# EAGLE design Elec 2013 Combined v2 (EAGLE 6.4)
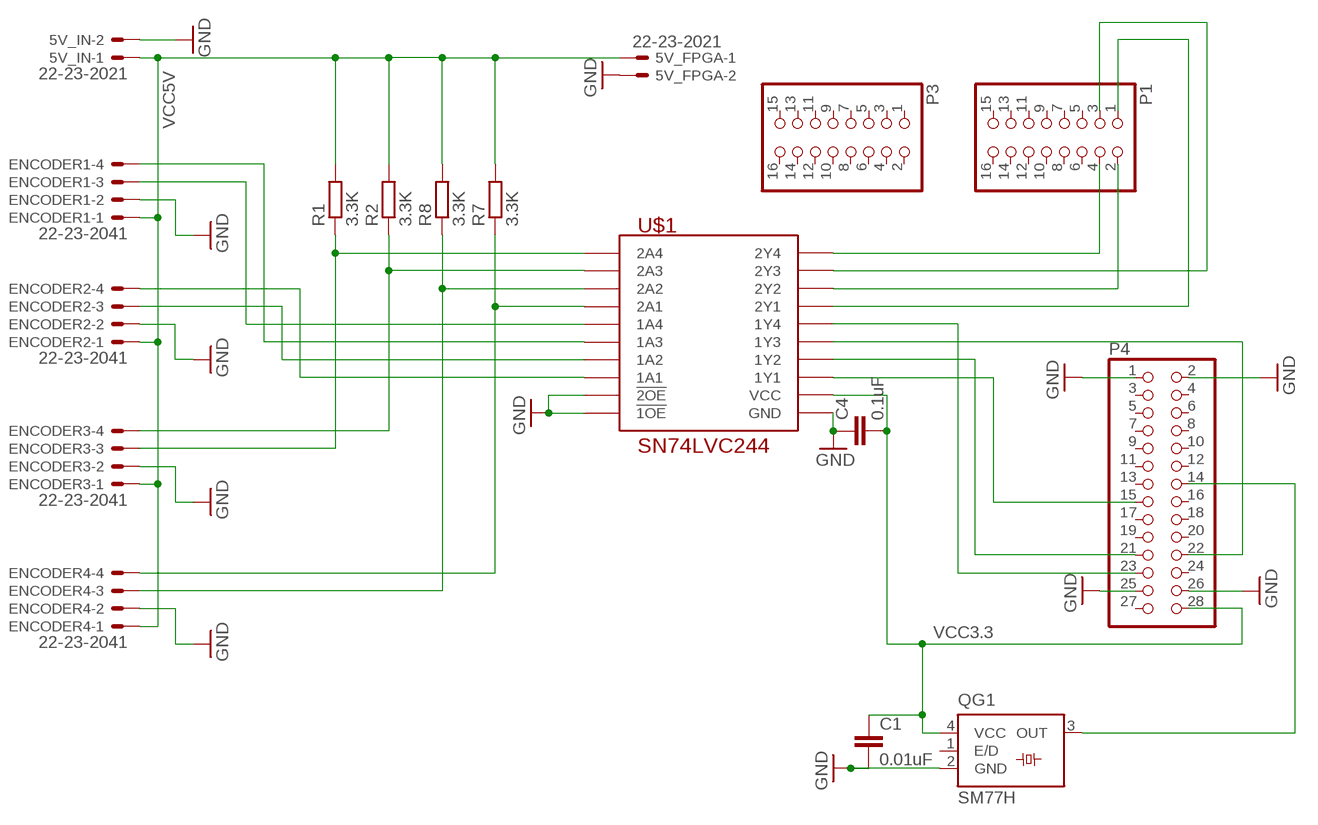
[diagram p0: schematic, sheet 1, part 1 of 2]
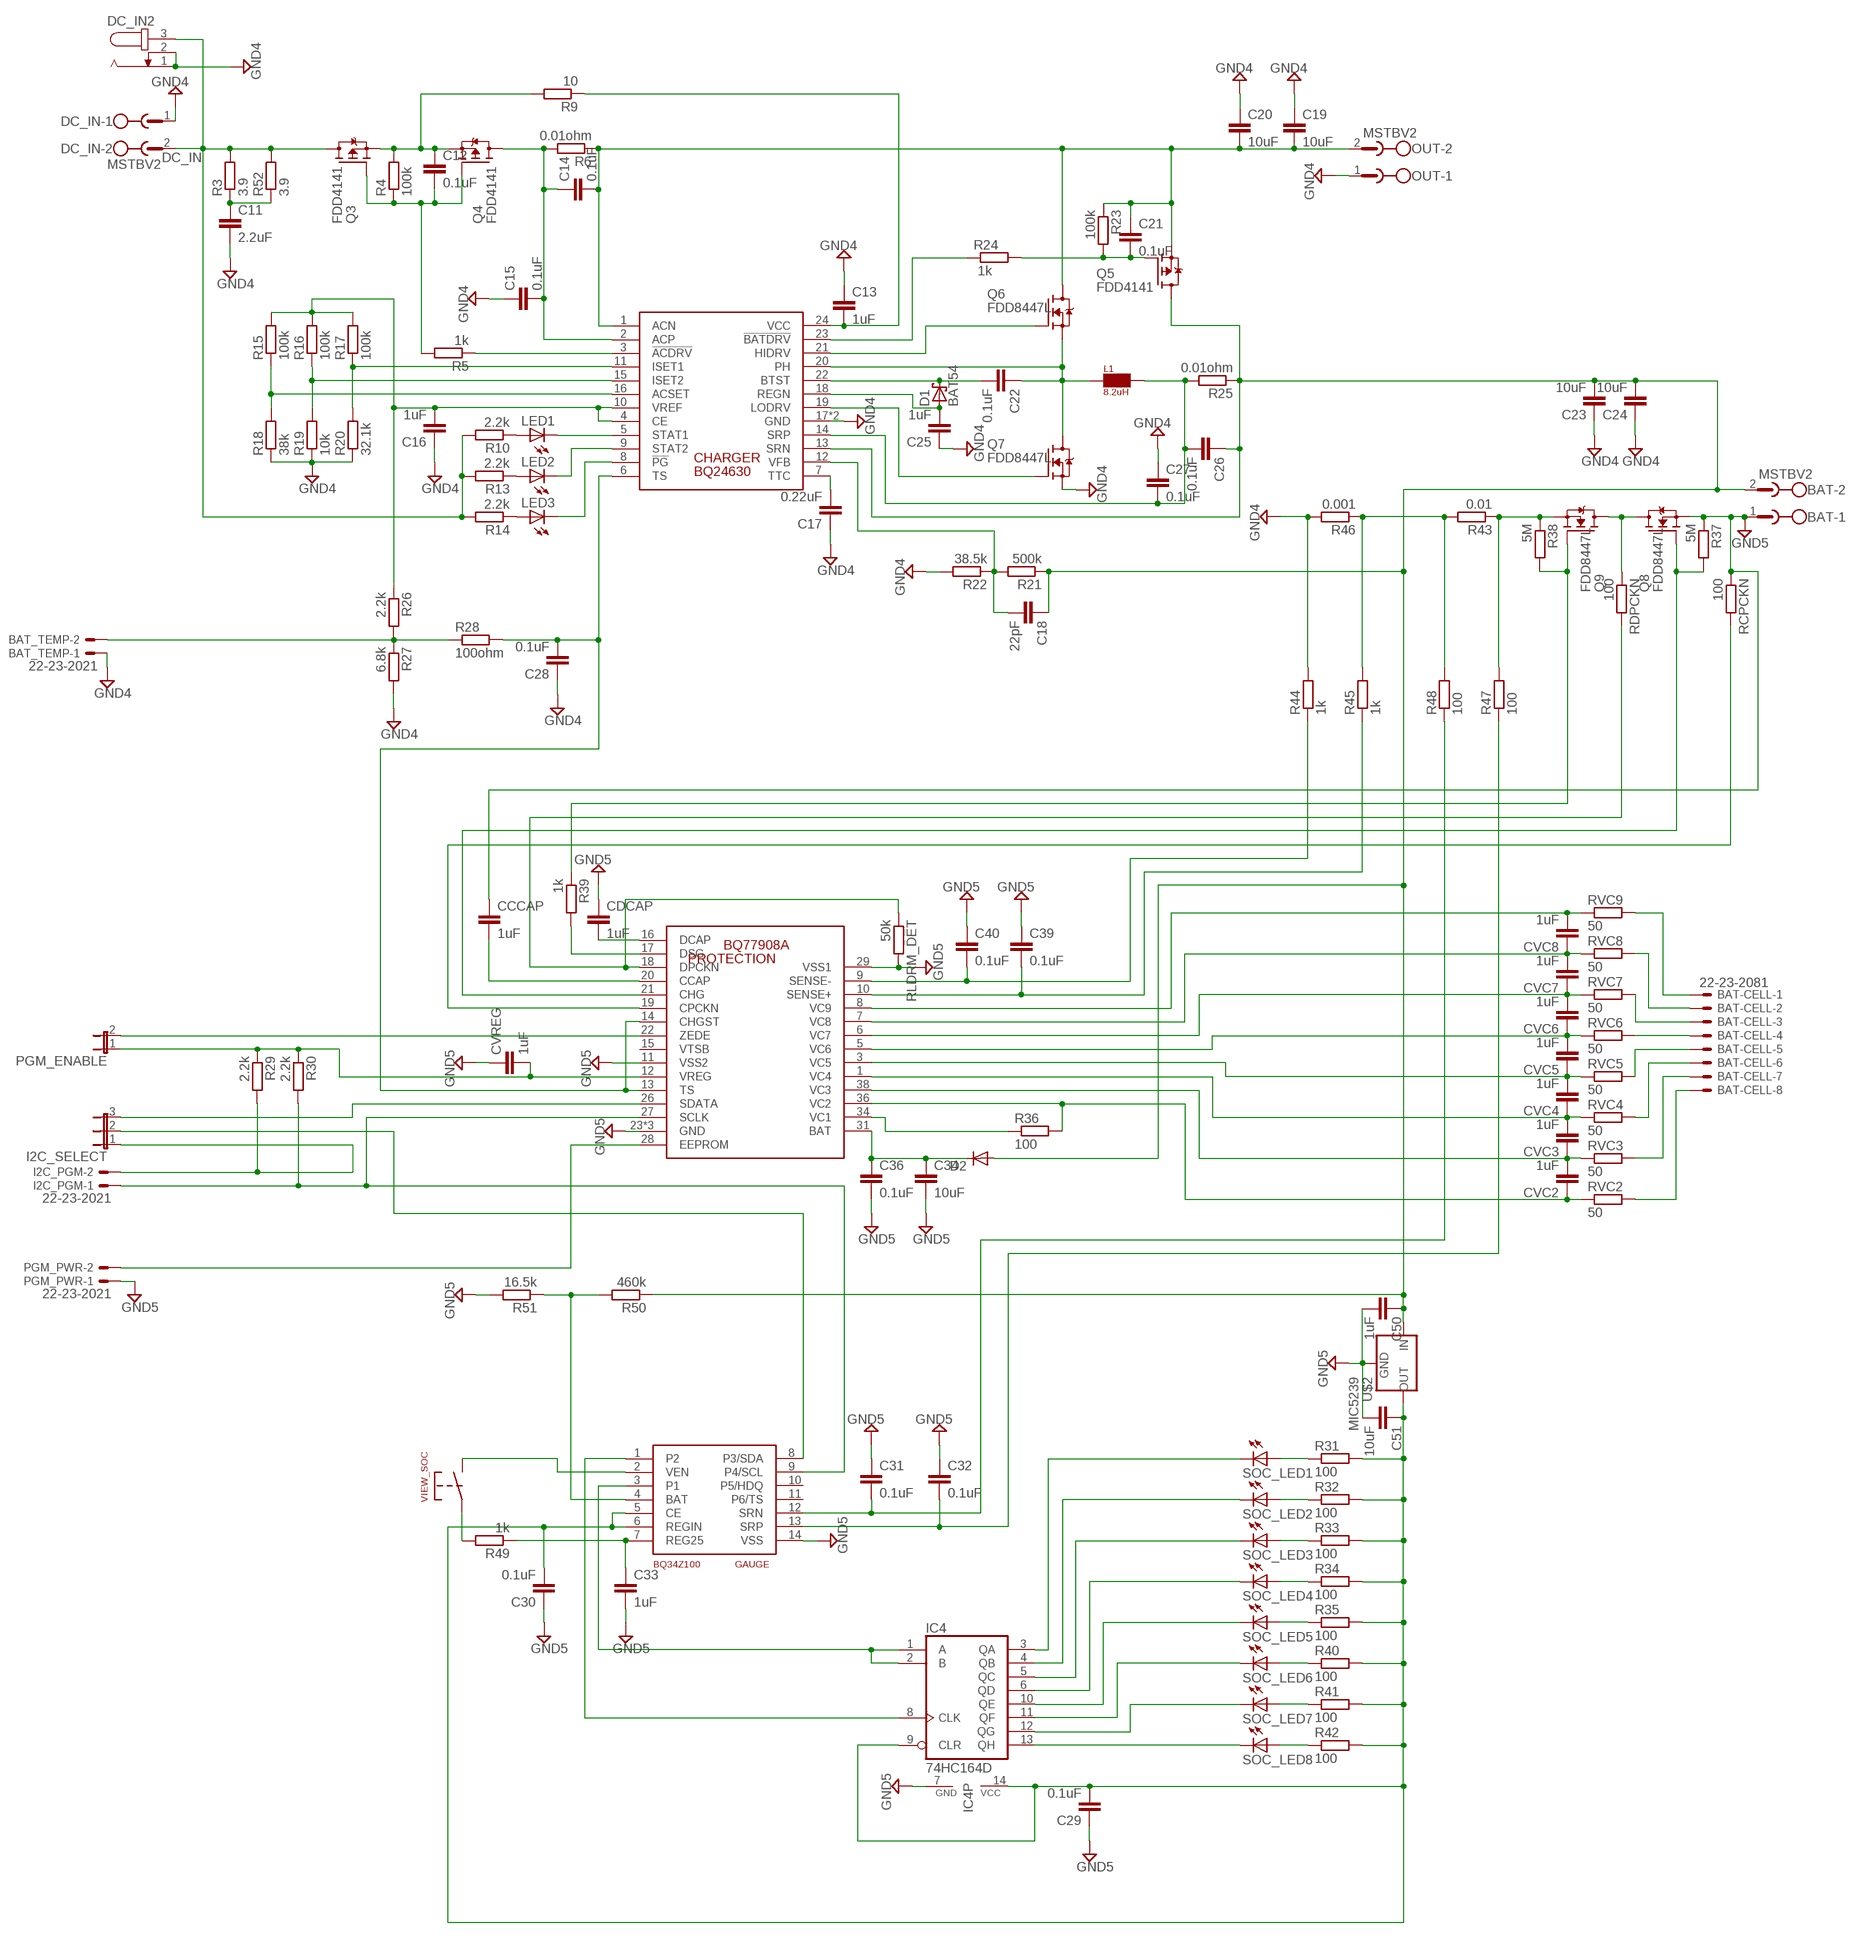
[diagram p1: schematic, sheet 1, part 2 of 2]

## Parts
5V_FPGA  22-23-2021  [22-23-2021]
5V_IN  22-23-2021  [22-23-2021]
BAT  MSTBV2  [MSTBV2]
BAT-CELL  22-23-2081  [22-23-2081]
BAT_TEMP  22-23-2021  [22-23-2021]
C1  0.01uF  C-EUC0603  [C0603]
C4  0.1uF  C-EUC0603  [C0603]
C11  2.2uF  C-EUC1206  [C1206]
C12  0.1uF  C-EUC0603  [C0603]
C13  1uF  C-EUC1206  [C1206]
C14  0.1uF  C-EUC0603  [C0603]
C15  0.1uF  C-EUC0603  [C0603]
C16  1uF  C-EUC0805  [C0805]
C17  0.22uF  C-EUC0603  [C0603]
C18  22pF  C-EUC0603  [C0603]
C19  10uF  C-EUC1812  [C1812]
C20  10uF  C-EUC1812  [C1812]
C21  0.1uF  C-EUC0603  [C0603]
C22  0.1uF  C-EUC0603  [C0603]
C23  10uF  C-EUC1812  [C1812]
C24  10uF  C-EUC1812  [C1812]
C25  1uF  C-EUC0805  [C0805]
C26  0.1uF  C-EUC0603  [C0603]
C27  0.1uF  C-EUC0603  [C0603]
C28  0.1uF  C-EUC0603  [C0603]
C29  0.1uF  C-EUC0603  [C0603]
C30  0.1uF  C-EUC0603  [C0603]
C31  0.1uF  C-EUC0603  [C0603]
C32  0.1uF  C-EUC0603  [C0603]
C33  1uF  C-EUC0603  [C0603]
C34  10uF  C-EUC1210  [C1210]
C36  0.1uF  C-EUC1210  [C1210]
C39  0.1uF  C-EUC0603  [C0603]
C40  0.1uF  C-EUC0603  [C0603]
C50  1uF  C-EUC0603  [C0603]
C51  10uF  C-EUC0603  [C0603]
CCCAP  1uF  C-EUC1206  [C1206]
CDCAP  1uF  C-EUC1206  [C1206]
CHARGER  BQ24630  [QFN-24]
CVC2  1uF  C-EUC0603  [C0603]
CVC3  1uF  C-EUC0603  [C0603]
CVC4  1uF  C-EUC0603  [C0603]
CVC5  1uF  C-EUC0603  [C0603]
CVC6  1uF  C-EUC0603  [C0603]
CVC7  1uF  C-EUC0603  [C0603]
CVC8  1uF  C-EUC0603  [C0603]
CVREG  1uF  C-EUC0603  [C0603]
D1  BAT54  [SOT23]
D2  DIODE-SOD123  [SOD123]
DC_IN  MSTBV2  [MSTBV2]
DC_IN2  JACK-PLUG1  [SPC4078]
ENCODER1  22-23-2041  [22-23-2041]
ENCODER2  22-23-2041  [22-23-2041]
ENCODER3  22-23-2041  [22-23-2041]
ENCODER4  22-23-2041  [22-23-2041]
GAUGE  BQ34Z100  [TSSOP-14-0.65MM]
I2C_PGM  22-23-2021  [22-23-2021]
I2C_SELECT  JP2E  [JP2]
IC4  74HC164D  [SO14]
L1  8.2uH  IHLP-5050CE  [5050CE]
LED1  LEDCHIP-LED0603  [CHIP-LED0603]
LED2  LEDCHIP-LED0603  [CHIP-LED0603]
LED3  LEDCHIP-LED0603  [CHIP-LED0603]
OUT  MSTBV2  [MSTBV2]
P1  PINHD-2X8  [2X08]
P3  PINHD-2X8  [2X08]
P4  PINHD-2X14  [2X14]
PGM_ENABLE  JP1E  [JP1]
PGM_PWR  22-23-2021  [22-23-2021]
PROTECTION  BQ77908A  [TSSOP-38-0.5MM]
Q3  FDD4141  FDD4141TO252  [TO252]
Q4  FDD4141  FDD4141TO252  [TO252]
Q5  FDD4141  FDD4141TO252  [TO252]
Q6  FDD8447L  [TO252]
Q7  FDD8447L  [TO252]
Q8  FDD8447L  [TO252]
Q9  FDD8447L  [TO252]
QG1  SM77H  [SM77H]
R1  3.3K  R-EU_R0603  [R0603]
R2  3.3K  R-EU_R0603  [R0603]
R3  3.9  R-EU_R1206  [R1206]
R4  100k  R-EU_R0603  [R0603]
R5  1k  R-EU_R0603  [R0603]
R6  0.01ohm  R-EU_R2010  [R2010]
R7  3.3K  R-EU_R0603  [R0603]
R8  3.3K  R-EU_R0603  [R0603]
R9  10  R-EU_R1206  [R1206]
R10  2.2k  R-EU_R0603  [R0603]
R13  2.2k  R-EU_R0603  [R0603]
R14  2.2k  R-EU_R0603  [R0603]
R15  100k  R-EU_R0805  [R0805]
R16  100k  R-EU_R0805  [R0805]
R17  100k  R-EU_R0805  [R0805]
R18  38k  R-EU_R0805  [R0805]
R19  10k  R-EU_R0805  [R0805]
R20  32.1k  R-EU_R0805  [R0805]
R21  500k  R-EU_R0805  [R0805]
R22  38.5k  R-EU_R0805  [R0805]
R23  100k  R-EU_R0603  [R0603]
R24  1k  R-EU_R0603  [R0603]
R25  0.01ohm  R-EU_R2010  [R2010]
R26  2.2k  R-EU_R0603  [R0603]
R27  6.8k  R-EU_R0603  [R0603]
R28  100ohm  R-EU_R0603  [R0603]
R29  2.2k  R-EU_R0603  [R0603]
R30  2.2k  R-EU_R0603  [R0603]
R31  100  R-EU_R0603  [R0603]
R32  100  R-EU_R0603  [R0603]
R33  100  R-EU_R0603  [R0603]
R34  100  R-EU_R0603  [R0603]
R35  100  R-EU_R0603  [R0603]
R36  100  R-EU_R0603  [R0603]
R37  5M  R-EU_R0603  [R0603]
R38  5M  R-EU_R0603  [R0603]
R39  1k  R-EU_R0603  [R0603]
R40  100  R-EU_R0603  [R0603]
R41  100  R-EU_R0603  [R0603]
R42  100  R-EU_R0603  [R0603]
R43  0.01  R-EU_R2010  [R2010]
R44  1k  R-EU_R0603  [R0603]
R45  1k  R-EU_R0603  [R0603]
R46  0.001  R-EU_R2010  [R2010]
R47  100  R-EU_R0603  [R0603]
R48  100  R-EU_R0603  [R0603]
R49  1k  R-EU_R0603  [R0603]
R50  460k  R-EU_R0805  [R0805]
R51  16.5k  R-EU_R0603  [R0603]
R52  3.9  R-EU_R1206  [R1206]
RCPCKN  100  R-EU_R0603  [R0603]
RDPCKN  100  R-EU_R0603  [R0603]
RLDRM_DET  50k  R-EU_R0603  [R0603]
RVC2  50  R-EU_R1206  [R1206]
RVC3  50  R-EU_R1206  [R1206]
RVC4  50  R-EU_R1206  [R1206]
RVC5  50  R-EU_R1206  [R1206]
RVC6  50  R-EU_R1206  [R1206]
RVC7  50  R-EU_R1206  [R1206]
RVC8  50  R-EU_R1206  [R1206]
RVC9  50  R-EU_R1206  [R1206]
SOC_LED1  LEDCHIP-LED0603  [CHIP-LED0603]
SOC_LED2  LEDCHIP-LED0603  [CHIP-LED0603]
SOC_LED3  LEDCHIP-LED0603  [CHIP-LED0603]
SOC_LED4  LEDCHIP-LED0603  [CHIP-LED0603]
SOC_LED5  LEDCHIP-LED0603  [CHIP-LED0603]
SOC_LED6  LEDCHIP-LED0603  [CHIP-LED0603]
SOC_LED7  LEDCHIP-LED0603  [CHIP-LED0603]
SOC_LED8  LEDCHIP-LED0603  [CHIP-LED0603]
U$1  SN74LVC244  [TSSOP-20-0.65MM]
U$2  MIC5239  [SOT223]
VIEW_SOC  PUSHBUTTON  [PUSHBUTTON]

## Nets
DC_IN: DC_IN2.3 DC_IN.2 Q3.3(D) R3.2 R10.2 R13.2 R14.2 R52.2
GND: 5V_FPGA.2 5V_IN.2 C1.2 C4.1 ENCODER1.2 ENCODER2.2 ENCODER3.2 ENCODER4.2 P4.1 P4.2 P4.25 P4.26 QG1.2(GND) U$1.P$1(!1OE) U$1.P$10(GND) U$1.P$19(!2OE)
GND4: BAT_TEMP.1 C11.2 C13.1 C15.1 C16.1 C17.1 C19.1 C20.1 C23.1 C24.1 C25.1 C27.1 C28.1 CHARGER.17(GND) CHARGER.THERMAL(GND) DC_IN2.1 DC_IN2.2 DC_IN.1 OUT.1 Q7.2(S) R18.1 R19.1 R20.1 R22.2 R27.2 R44.2 R46.2
GND5: BAT.1 C29.1 C30.1 C31.1 C32.1 C33.2 C34.2 C36.2 C39.1 C40.1 C50.2 C51.2 CCCAP.1 CDCAP.1 CVREG.1 GAUGE.14(VSS) IC4.7(GND) PGM_PWR.1 PROTECTION.11(VSS2) PROTECTION.23(GND) PROTECTION.24(GND) PROTECTION.25(GND) PROTECTION.29(VSS1) Q8.2(S) R37.1 R51.2 RCPCKN.1 RLDRM_DET.2 U$2.2(GND) U$2.4(GND)
N$1: P4.14 QG1.3(OUT)
N$2: P4.23 U$1.P$12(1Y4)
N$3: P4.21 U$1.P$16(1Y2)
N$4: P4.15 U$1.P$18(1Y1)
N$5: P4.22 U$1.P$14(1Y3)
N$6: P1.4 U$1.P$3(2Y4)
N$7: P1.2 U$1.P$7(2Y2)
N$8: P1.1 U$1.P$9(2Y1)
N$9: P1.3 U$1.P$5(2Y3)
N$10: ENCODER3.3 R1.1 U$1.P$17(2A4)
N$11: ENCODER3.4 R2.1 U$1.P$15(2A3)
N$13: C11.1 R3.1 R52.1
N$14: ENCODER4.3 R8.1 U$1.P$13(2A2)
N$15: ENCODER4.4 R7.1 U$1.P$11(2A1)
N$16: ENCODER1.3 U$1.P$8(1A4)
N$17: ENCODER1.4 U$1.P$6(1A3)
N$18: ENCODER2.3 U$1.P$4(1A2)
N$19: ENCODER2.4 U$1.P$2(1A1)
N$41: C12.1 Q3.2(S) Q4.2(S) R4.2 R9.2
N$42: C12.2 Q3.1(G) Q4.1(G) R4.1 R5.2
N$43: CHARGER.3(!ACDRV!) R5.1
N$44: C17.2 CHARGER.7(TTC)
N$45: C13.2 CHARGER.24(VCC) R9.1
N$46: C14.2 C19.2 C20.2 C21.1 CHARGER.1(ACN) OUT.2 Q5.2(S) Q6.3(D) R6.1 R23.1
N$47: C18.2 CHARGER.12(VFB) R21.2 R22.1
N$48: CHARGER.5(STAT1) LED1.C
N$49: CHARGER.9(STAT2) LED2.C
N$50: CHARGER.8(!PG!) LED3.C
N$51: LED1.A R10.1
N$52: LED2.A R13.1
N$53: LED3.A R14.1
N$54: BAT_TEMP.2 R26.2 R27.1 R28.1
N$55: CHARGER.16(ACSET) R15.1 R18.2
N$56: CHARGER.15(ISET2) R16.1 R19.2
N$57: CHARGER.11(ISET1) R17.1 R20.2
N$58: Q8.3(D) Q9.3(D) RDPCKN.1
N$59: C28.2 CHARGER.6(TS) PROTECTION.13(TS) PROTECTION.14(CHGST) R28.2
N$60: C21.2 Q5.1(G) R23.2 R24.2
N$61: C32.2 GAUGE.13(SRP) R47.1
N$62: CHARGER.23(!BATDRV!) R24.1
N$63: CHARGER.21(HIDRV) Q6.1(G)
N$64: C22.1 CHARGER.20(PH) L1.P$1 Q6.2(S) Q7.3(D)
N$65: C22.2 CHARGER.22(BTST) D1.3(C)
N$66: C34.1 C36.1 D2.C PROTECTION.31(BAT)
N$67: C26.2 C27.2 CHARGER.14(SRP) L1.P$2 R25.2
N$68: BAT-CELL.8 RVC2.2
N$69: C25.2 CHARGER.18(REGN) D1.1(A)
N$70: CHARGER.19(LODRV) Q7.1(G)
N$71: CVC8.2 PROTECTION.8(VC9) RVC9.1
N$72: CVC2.1 PROTECTION.36(VC2) R36.2 RVC2.1
N$73: CVC4.2 CVC5.1 PROTECTION.3(VC5) RVC5.1
N$74: CVC2.2 CVC3.1 PROTECTION.38(VC3) RVC3.1
N$75: PROTECTION.34(VC1) R36.1
N$76: CVC6.2 CVC7.1 PROTECTION.6(VC7) RVC7.1
N$77: CVC5.2 CVC6.1 PROTECTION.5(VC6) RVC6.1
N$78: CVC3.2 CVC4.1 PROTECTION.1(VC4) RVC4.1
N$79: BAT-CELL.7 RVC3.2
N$80: BAT-CELL.6 RVC4.2
N$81: BAT-CELL.5 RVC5.2
N$82: BAT-CELL.4 RVC6.2
N$83: BAT-CELL.3 RVC7.2
N$84: BAT-CELL.2 RVC8.2
N$85: BAT-CELL.1 RVC9.2
N$86: C33.1 GAUGE.7(REG25) R49.1
N$87: Q9.1(G) R38.2 R39.1
N$88: PROTECTION.21(CHG) Q8.1(G) R37.2
N$89: PROTECTION.17(DSG) R39.2
N$90: CDCAP.2 PROTECTION.16(DCAP)
N$91: CVC7.2 CVC8.1 PROTECTION.7(VC8) RVC8.1
N$92: PROTECTION.18(DPCKN) RDPCKN.2 RLDRM_DET.1
N$93: R31.1 SOC_LED1.A
N$94: PROTECTION.19(CPCKN) RCPCKN.2
N$95: CCCAP.2 PROTECTION.20(CCAP)
N$96: R32.1 SOC_LED2.A
N$97: C39.2 PROTECTION.10(SENSE+) R45.1
N$99: C40.2 PROTECTION.9(SENSE-) R44.1
N$100: GAUGE.9(P4/SCL) I2C_PGM.1 PROTECTION.27(SCLK) R30.2
N$101: I2C_PGM.2 I2C_SELECT.1 R29.2
N$102: R33.1 SOC_LED3.A
N$103: PGM_ENABLE.2 PROTECTION.22(ZEDE)
N$104: PGM_PWR.2 PROTECTION.28(EEPROM)
N$105: C29.2 C30.2 C51.1 GAUGE.5(CE) GAUGE.6(REGIN) IC4.9(CLR) IC4.14(VCC) R31.2 R32.2 R33.2 R34.2 R35.2 R40.2 R41.2 R42.2 U$2.3(OUT)
N$106: R34.1 SOC_LED4.A
N$107: R35.1 SOC_LED5.A
N$108: R40.1 SOC_LED6.A
N$109: R41.1 SOC_LED7.A
N$110: R42.1 SOC_LED8.A
N$111: IC4.13(QH) SOC_LED8.C
N$112: IC4.3(QA) SOC_LED1.C
N$113: IC4.4(QB) SOC_LED2.C
N$114: IC4.5(QC) SOC_LED3.C
N$115: IC4.6(QD) SOC_LED4.C
N$116: IC4.10(QE) SOC_LED5.C
N$118: IC4.12(QG) SOC_LED7.C
N$120: I2C_SELECT.3 PROTECTION.26(SDATA)
N$121: GAUGE.8(P3/SDA) I2C_SELECT.2
N$122: C31.2 GAUGE.12(SRN) R48.1
N$123: GAUGE.3(P1) IC4.1(A) IC4.2(B)
N$124: GAUGE.1(P2) IC4.8(CLK)
N$126: R49.2 VIEW_SOC.P$1 VIEW_SOC.P$2
N$127: GAUGE.2(VEN) VIEW_SOC.P$3 VIEW_SOC.P$4
N$128: GAUGE.4(BAT) R50.2 R51.1
N$129: BAT.2 C18.1 C23.2 C24.2 C26.1 C50.1 CHARGER.13(SRN) D2.A Q5.3(D) R21.1 R25.1 R50.1 U$2.1(IN)
N$130: CVREG.2 PGM_ENABLE.1 PROTECTION.12(VREG) R29.1 R30.1
N$131: R43.2 R45.2 R46.1 R48.2
N$132: Q9.2(S) R38.1 R43.1 R47.2
SI7617DN: C14.1 C15.2 CHARGER.2(ACP) Q4.3(D) R6.2
SOC_LED6: IC4.11(QF) SOC_LED6.C
VCC3.3: C1.1 C4.2 P4.28 QG1.4(VCC) U$1.P$20(VCC)
VCC5V: 5V_FPGA.1 5V_IN.1 ENCODER1.1 ENCODER2.1 ENCODER3.1 ENCODER4.1 R1.2 R2.2 R7.2 R8.2
VREF: C16.2 CHARGER.4(CE) CHARGER.10(VREF) R15.2 R16.2 R17.2 R26.1
Unconnected: GAUGE.10(P5/HDQ) GAUGE.11(P6/TS) P1.5 P1.6 P1.7 P1.8 P1.9 P1.10 P1.11 P1.12 P1.13 P1.14 P1.15 P1.16 P3.1 P3.2 P3.3 P3.4 P3.5 P3.6 P3.7 P3.8 P3.9 P3.10 P3.11 P3.12 P3.13 P3.14 P3.15 P3.16 P4.3 P4.4 P4.5 P4.6 P4.7 P4.8 P4.9 P4.10 P4.11 P4.12 P4.13 P4.16 P4.17 P4.18 P4.19 P4.20 P4.24 P4.27 PROTECTION.15(VTSB) QG1.1(E/D)

## Library data of the parts
5V_FPGA 5V_IN BAT_TEMP I2C_PGM PGM_PWR = con-molex:22-23-2021: .100" (2.54mm) Center Header - 2 Pin; MF: MOLEX; MPN: 22-23-2021; OC_FARNELL: 1462926; OC_NEWARK: 25C3832
BAT DC_IN OUT = con-phoenix-508:MSTBV2: PHOENIX; MPN: MSTBV 2,5/2-GF-5.08; OC_FARNELL: 1792792; OC_NEWARK: 69R9845
BAT-CELL = con-molex:22-23-2081: .100" (2.54mm) Center Header - 8 Pin; MF: MOLEX; MPN: 22-23-2081; OC_FARNELL: 1756826; OC_NEWARK: 01C7592
C1 C4 C11-C34 C36 C39 C40 C50 C51 CCCAP CDCAP CVC2-CVC8 CVREG = rcl:C-EU: CAPACITOR, European symbol
CHARGER = custom:BQ24630
D1 = diode:BAT54: Schottky Diodes Source: Fairchild .. BAT54.pdf
D2 = diode:DIODE-: DIODE
DC_IN2 = con-jack:JACK-PLUG: DC POWER JACK Power Jack, DC, Right Angle, Through Hole, Rated 5A at 16VDC, PC Terminals Distributor: Farnell (www.Farnell.de) Drawing: 84N1161.pdf / 84N1162.pdf Manufacturer: SPC Technology (www.spctechnology.com) Type: SPC4077 / SPC 4078; OC_FARNELL: unknown; OC_NEWARK: unknown
ENCODER1-ENCODER4 = con-molex:22-23-2041: .100" (2.54mm) Center Header - 4 Pin; MF: MOLEX; MPN: 22-23-2041; OC_FARNELL: 1462920; OC_NEWARK: 38C0355
GAUGE = custom:BQ34Z100
I2C_SELECT = jumper:JP2E: JUMPER
IC4 = 74xx-eu:74*164: 8-bit parallel out SHIFT REGISTER
L1 = custom:IHLP-5050CE
LED1-LED3 SOC_LED1-SOC_LED8 = led:LED: LED OSRAM: - CHIPLED LG R971, LG N971, LY N971, LG Q971, LY Q971, LO R971, LY R971 LH N974, LH R974 LS Q976, LO Q976, LY Q976 LO Q996 - Hyper CHIPLED LW Q18S LB Q993, LB Q99A, LB R99A - SideLED LS A670, LO A670, LY A670, LG A670, LP A670 LB A673, LV A673, LT A673, LW A673 LH A674 LY A675 LS A676, LA A676, LO A676, LY A676, LW A676 LS A679, LY A679, LG A679 - Hyper Micro SIDELED® LS Y876, LA Y876, LO Y876, LY Y876 LT Y87S - SmartLED LW L88C, LW L88S LB L89C, LB L89S, LG L890 LS L89K, LO L89K, LY L89K LS L896, LA L896, LO L896, LY L896 - TOPLED LS T670, LO T670, LY T670, LG T670, LP T670 LSG T670, LSP T670, LSY T670, LOP T670, LYG T670 LG T671, LOG T671, LSG T671 LB T673, LV T673, LT T673, LW T673 LH T674 LS T676, LA T676, LO T676, LY T676, LB T676, LH T676, LSB T676, LW T676 LB T67C, LV T67C, LT T67C, LS T67K, LO T67K, LY T67K, LW E67C LS E67B, LA E67B, LO E67B, LY E67B, LB E67C, LV E67C, LT E67C LW T67C LS T679, LY T679, LG T679 LS T770, LO T770, LY T770, LG T770, LP T770 LB T773, LV T773, LT T773, LW T773 LH T774 LS E675, LA E675, LY E675, LS T675 LS T776, LA T776, LO T776, LY T776, LB T776 LHGB T686 LT T68C, LB T68C - Hyper Mini TOPLED® LB M676 - Mini TOPLED Santana® LG M470 LS M47K, LO M47K, LY M47K Source: http://www.osram.convergy.de LUXEON: - LUMILED® LXK2-PW12-R00, LXK2-PW12-S00, LXK2-PW14-U00, LXK2-PW14-V00 LXK2-PM12-R00, LXK2-PM12-S00, LXK2-PM14-U00 LXK2-PE12-Q00, LXK2-PE12-R00, LXK2-PE12-S00, LXK2-PE14-T00, LXK2-PE14-U00 LXK2-PB12-K00, LXK2-PB12-L00, LXK2-PB12-M00, LXK2-PB14-N00, LXK2-PB14-P00, LXK2-PB14-Q00 LXK2-PR12-L00, LXK2-PR12-M00, LXK2-PR14-Q00, LXK2-PR14-R00 LXK2-PD12-Q00, LXK2-PD12-R00, LXK2-PD12-S00 LXK2-PH12-R00, LXK2-PH12-S00 LXK2-PL12-P00, LXK2-PL12-Q00, LXK2-PL12-R00 Source: www.luxeon.com KINGBRIGHT: KA-3528ASYC Source: www.kingbright.com
P1 P3 = pinhead:PINHD-2X8: PIN HEADER
P4 = pinhead:PINHD-2X14: PIN HEADER
PGM_ENABLE = jumper:JP1E: JUMPER
PROTECTION = custom:BQ77908A
Q3-Q5 = transistor-fet:FDD4141: P-Channel PowerTrench® MOSFET Source: FDD4141.pdf
Q6-Q9 = transistor-fet:FDD8447L
QG1 = custom:SM77H: 3.3V CMOS Clock Oscillator Source: www.pletronics.com .. sm77h%203.3v.pdf; OC_FARNELL: unknown; OC_NEWARK: unknown
R1-R10 R13-R52 RCPCKN RDPCKN RLDRM_DET RVC2-RVC9 = rcl:R-EU_: RESISTOR, European symbol
U$1 = custom:SN74LVC244
U$2 = v-reg:MIC5239
VIEW_SOC = custom:PUSHBUTTON

## Board
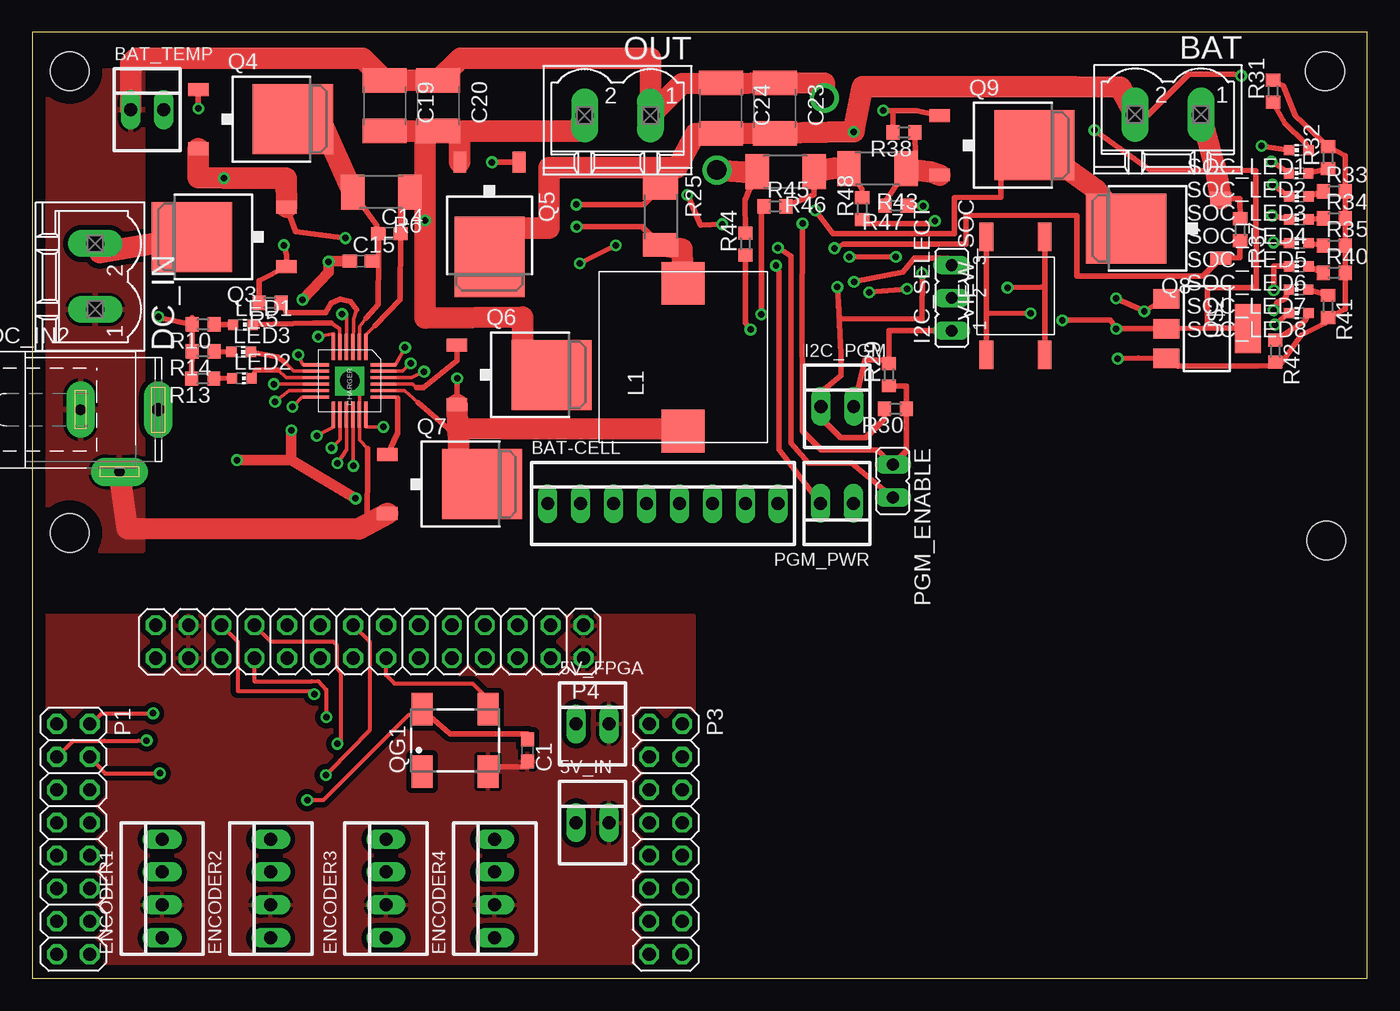
[diagram p2: board, top side]
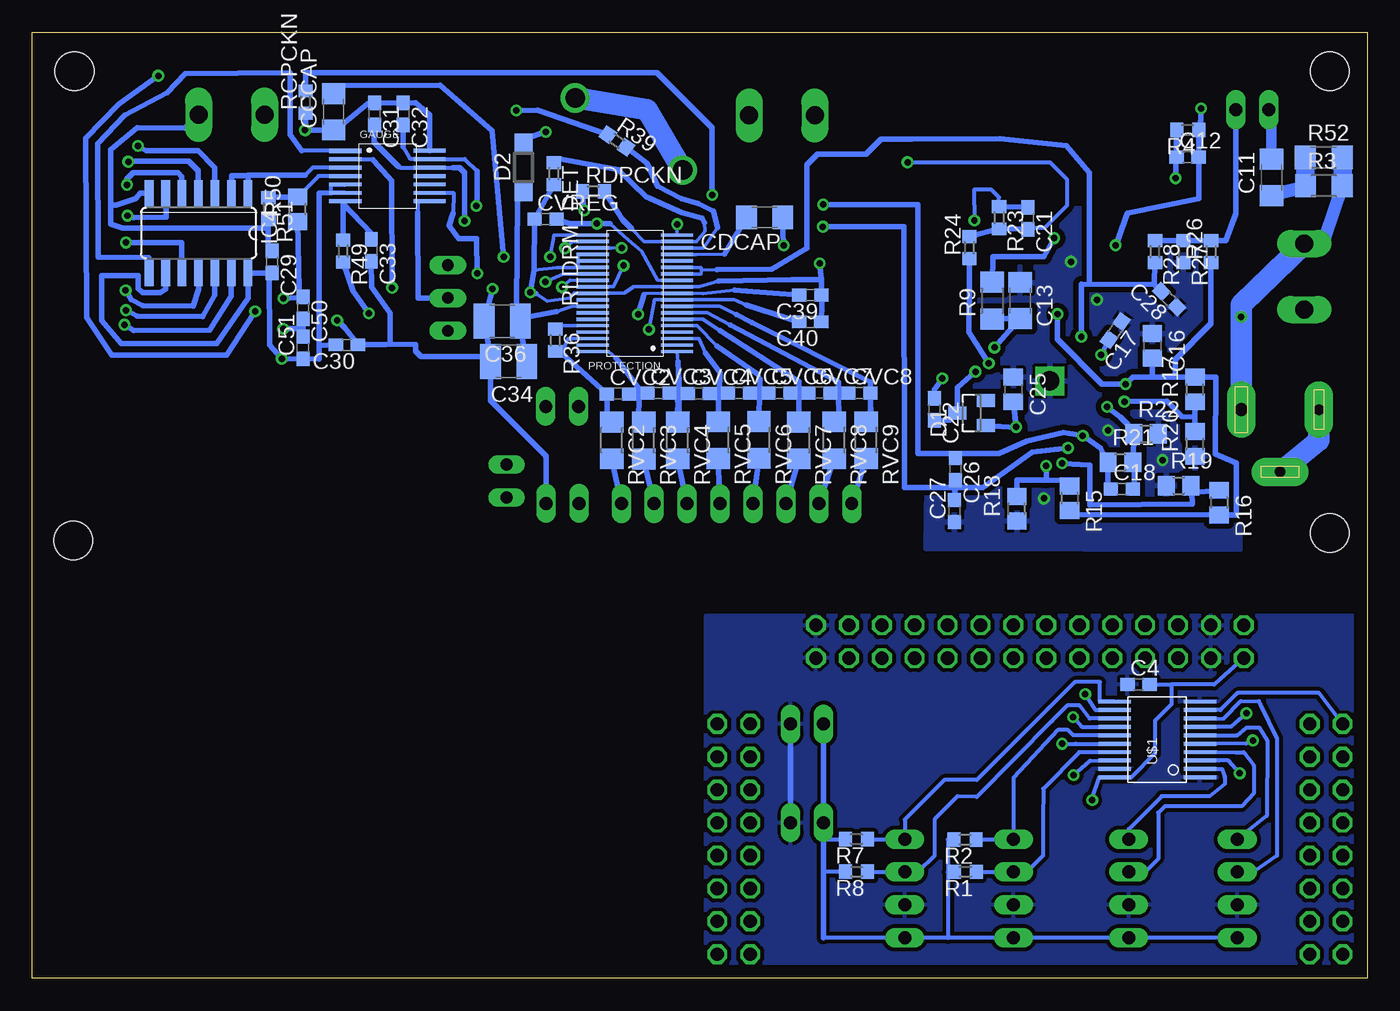
[diagram p3: board, bottom side, seen from below]

Size 103 x 73 mm. Coordinates in mm from the lower left corner, seen from the top.
Outline: 0,0 103,0 103,73 0,73 0,0
Copper layers (1*16): Top 0.035mm / dielectric 1.5mm / Bottom 0.035mm
Design rules "default *": minimum track width 8mil, minimum drill 0.3mm, track to track 8mil, track to pad 8mil, pad to pad 8mil, via to via 8mil, smd to smd 8mil, copper to edge 40mil, drill to drill 8mil, minimum pad ring 10mil, minimum via ring 8mil, stop-mask expansion 4mil, vias tented up to drill 0mil, thermal gap 10mil
Holes 3 mm at 2.89,34.37 2.89,70 99.76,70 99.84,33.78

### Footprints (pad centres in the part's own frame; a part is rotated, then mirrored left to right if it is on the bottom)
22-23-2021 = drill 1 long: 1 -1.27,0; 2 1.27,0
MSTBV2 = drill 1.397 long: 1 -2.54,0; 2 2.54,0
22-23-2081 = drill 1 long: 1 -8.89,0; 2 -6.35,0; 3 -3.81,0; 4 -1.27,0; 5 1.27,0; 6 3.81,0; 7 6.35,0; 8 8.89,0
C0603 = smd 1.1 x 1: 1 -0.85,0; 2 0.85,0
C1206 = smd 1.6 x 1.8: 1 -1.4,0; 2 1.4,0
C0805 = smd 1.3 x 1.5: 1 -0.95,0; 2 0.95,0
C1812 = smd 1.9 x 3.4: 1 -1.95,0; 2 1.95,0
C1210 = smd 1.6 x 2.7: 1 -1.4,0; 2 1.4,0
QFN-24 = smd 2 x 0.25: 1 -2.6,1.25; 2 -2.6,0.75; 3 -2.6,0.25; 4 -2.6,-0.25; 5 -2.6,-0.75; 6 -2.6,-1.25; 13 2.6,-1.25; 14 2.6,-0.75; 15 2.6,-0.25; 16 2.6,0.25; 17 2.6,0.75; 18 2.6,1.25 | smd 0.25 x 2: 7 -1.25,-2.6; 8 -0.75,-2.6; 9 -0.25,-2.6; 10 0.25,-2.6; 11 0.75,-2.6; 12 1.25,-2.6; 19 1.25,2.6; 20 0.75,2.6; 21 0.25,2.6; 22 -0.25,2.6; 23 -0.75,2.6; 24 -1.25,2.6 | drill 1.5 pad 1.93 square: THERMAL 0,0
SOT23 = smd 1 x 1.4: 1 -0.95,-1.1; 2 0.95,-1.1; 3 0,1.1
SOD123 = smd 1.4 x 1.4: A 1.9,0; C -1.9,0
SPC4078 = drill 0.8 pad 2.184 long: 1 -3,0; 2 0,-4.8 | drill 1 pad 2.184 long: 3 3,0
22-23-2041 = drill 1 long: 1 -3.81,0; 2 -1.27,0; 3 1.27,0; 4 3.81,0
TSSOP-14-0.65MM = smd 2.5 x 0.35: 1 -3.25,1.95 | smd 2.5 x 0.3: 2 -3.25,1.3; 3 -3.25,0.65; 4 -3.25,0; 5 -3.25,-0.65; 6 -3.25,-1.3; 7 -3.25,-1.95; 8 3.25,-1.95; 9 3.25,-1.3; 10 3.25,-0.65; 11 3.25,0; 12 3.25,0.65; 13 3.25,1.3; 14 3.25,1.95
JP2 = drill 0.914 long: 1 -2.54,0; 2 0,0; 3 2.54,0
SO14 = smd 0.66 x 2.032: 1 -3.81,-3.073; 2 -2.54,-3.073; 3 -1.27,-3.073; 4 0,-3.073; 5 1.27,-3.073; 6 2.54,-3.073; 7 3.81,-3.073; 8 3.81,3.073; 9 2.54,3.073; 10 1.27,3.073; 11 0,3.073; 12 -1.27,3.073; 13 -2.54,3.073; 14 -3.81,3.073
5050CE = smd 3.3 x 3.3: P$1 -5.7,0; P$2 5.7,0
CHIP-LED0603 = smd 0.8 x 0.8: A 0,-0.75; C 0,0.75
2X08 = drill 1.016 octagon: 1 -8.89,-1.27; 2 -8.89,1.27; 3 -6.35,-1.27; 4 -6.35,1.27; 5 -3.81,-1.27; 6 -3.81,1.27; 7 -1.27,-1.27; 8 -1.27,1.27; 9 1.27,-1.27; 10 1.27,1.27; 11 3.81,-1.27; 12 3.81,1.27; 13 6.35,-1.27; 14 6.35,1.27; 15 8.89,-1.27; 16 8.89,1.27
2X14 = drill 1.016 octagon: 1 -16.51,-1.27; 2 -16.51,1.27; 3 -13.97,-1.27; 4 -13.97,1.27; 5 -11.43,-1.27; 6 -11.43,1.27; 7 -8.89,-1.27; 8 -8.89,1.27; 9 -6.35,-1.27; 10 -6.35,1.27; 11 -3.81,-1.27; 12 -3.81,1.27; 13 -1.27,-1.27; 14 -1.27,1.27; 15 1.27,-1.27; 16 1.27,1.27; 17 3.81,-1.27; 18 3.81,1.27; 19 6.35,-1.27; 20 6.35,1.27; 21 8.89,-1.27; 22 8.89,1.27; 23 11.43,-1.27; 24 11.43,1.27; 25 13.97,-1.27; 26 13.97,1.27; 27 16.51,-1.27; 28 16.51,1.27
JP1 = drill 0.914 long: 1 0,-1.27; 2 0,1.27
TSSOP-38-0.5MM = smd 2.5 x 0.25: 1 -3.25,4.65; 2 -3.25,4.15; 3 -3.25,3.65; 4 -3.25,3.15; 5 -3.25,2.65; 6 -3.25,2.15; 7 -3.25,1.65; 8 -3.25,1.15; 9 -3.25,0.65; 10 -3.25,0.15; 11 -3.25,-0.35; 12 -3.25,-0.85; 13 -3.25,-1.35; 14 -3.25,-1.85; 15 -3.25,-2.35; 16 -3.25,-2.85; 17 -3.25,-3.35; 18 -3.25,-3.85; 19 -3.25,-4.35; 20 3.25,-4.35; 21 3.25,-3.85; 22 3.25,-3.35; 23 3.25,-2.85; 24 3.25,-2.35; 25 3.25,-1.85; 26 3.25,-1.35; 27 3.25,-0.85; 28 3.25,-0.35; 29 3.25,0.15; 30 3.25,0.65; 31 3.25,1.15; 32 3.25,1.65; 33 3.25,2.15; 34 3.25,2.65; 35 3.25,3.15; 36 3.25,3.65; 37 3.25,4.15; 38 3.25,4.65
TO252 = smd 1 x 1.6: 1 -2.28,-4.8; 2 2.28,-4.8 | smd 5.4 x 6.2: 3 0,2.5
SM77H = smd 1.6 x 2.5: 1 -2.55,-2.4; 2 2.55,-2.4; 3 2.55,2.4; 4 -2.55,2.4
R0603 = smd 1 x 1.1: 1 -0.85,0; 2 0.85,0
R1206 = smd 1.6 x 1.803: 1 -1.422,0; 2 1.422,0
R2010 = smd 1.8 x 2.7: 1 -2.2,0; 2 2.2,0
R0805 = smd 1.3 x 1.5: 1 -0.95,0; 2 0.95,0
TSSOP-20-0.65MM = smd 0.3 x 2.5: P$1 -2.925,-3.3; P$2 -2.275,-3.3; P$3 -1.625,-3.3; P$4 -0.975,-3.3; P$5 -0.325,-3.3; P$6 0.325,-3.3; P$7 0.975,-3.3; P$8 1.625,-3.3; P$9 2.275,-3.3; P$10 2.925,-3.3; P$11 2.925,3.3; P$12 2.275,3.3; P$13 1.625,3.3; P$14 0.975,3.3; P$15 0.325,3.3; P$16 -0.325,3.3; P$17 -0.975,3.3; P$18 -1.625,3.3; P$19 -2.275,3.3; P$20 -2.925,3.3
SOT223 = smd 1.5 x 2: 1 -2.3,-3.15; 2 0,-3.15; 3 2.3,-3.15 | smd 3.8 x 2: 4 0,3.15
PUSHBUTTON = smd 2.184 x 1.067: P$1 -4.55,2.25; P$2 4.55,2.25; P$3 -4.55,-2.25; P$4 4.55,-2.25

### Placement (x,y rotation side)
5V_FPGA  43.23,19.62 0 top
5V_IN  43.23,12 0 top
BAT  87.63,66.65 180 top
BAT-CELL  48.66,36.64 0 top
BAT_TEMP  8.86,67.03 0 top
C1  38.21,17.59 270 top
C4  17.64,22.67 0 bottom
C11  7.39,61.81 90 bottom
C12  13.85,63.38 0 bottom
C13  26.78,52.3 270 bottom
C14  27.56,57.48 0 top
C15  25.34,55.33 0 top
C16  16.57,48.8 270 bottom
C17  19.44,49.98 235 bottom
C18  18.93,37.76 0 bottom
C19  27.2,67.34 270 top
C20  31.32,67.34 270 top
C21  26.18,58.65 270 bottom
C22  33.4,43.9 270 bottom
C23  57.29,67.15 270 top
C24  53.13,67.14 270 top
C25  27.3,45.44 270 bottom
C26  31.79,39.29 270 bottom
C27  31.85,36.06 90 bottom
C28  15.29,52.41 135 bottom
C29  84.49,55.29 270 bottom
C30  78.73,48.89 180 bottom
C31  76.6,66.71 270 bottom
C32  74.37,66.7 270 bottom
C33  76.84,56.17 270 bottom
C34  66.25,47.61 180 bottom
C36  66.75,50.71 180 bottom
C39  42.97,52.73 180 bottom
C40  42.97,50.66 180 bottom
C50  82.11,51.73 270 bottom
C51  82.12,48.67 90 bottom
CCCAP  79.76,66.86 90 bottom
CDCAP  46.5,58.72 180 bottom
CHARGER  24.48,46.1 270 top
CVC2  57.81,45.1 0 bottom
CVC3  54.67,45.15 0 bottom
CVC4  51.57,45.11 0 bottom
CVC5  48.46,45.16 0 bottom
CVC6  45.35,45.17 0 bottom
CVC7  42.25,45.18 0 bottom
CVC8  39.17,45.15 0 bottom
CVREG  63.4,58.57 0 bottom
D1  30.52,43.62 90 bottom
D2  65.09,62.59 90 bottom
DC_IN  4.85,54.16 90 top
DC_IN2  6.71,43.88 0 top
ENCODER1  10.02,6.92 90 top
ENCODER2  18.4,6.92 90 top
ENCODER3  27.29,6.92 90 top
ENCODER4  35.68,6.92 90 top
GAUGE  75.6,61.92 0 bottom
I2C_PGM  62.11,44.13 0 top
I2C_SELECT  70.94,52.51 90 top
IC4  90.18,57.51 180 bottom
L1  50.21,47.93 90 top
LED1  16.25,50.44 270 top
LED2  16.17,46.3 270 top
LED3  16.11,48.34 270 top
OUT  45.15,66.59 180 top
P1  3.16,10.73 270 top
P3  48.88,10.73 270 top
P4  26.02,25.97 180 top
PGM_ENABLE  66.41,38.38 180 top
PGM_PWR  62.08,36.64 180 top
PROTECTION  56.5,53.01 180 bottom
Q3  14.81,57.22 90 top
Q4  17.61,66.31 270 top
Q5  35.27,58.18 180 top
Q6  37.56,46.57 270 top
Q7  32.2,38.13 270 top
Q8  86.91,57.87 90 top
Q9  74.82,64.28 270 top
QG1  32.62,18.35 0 top
R1  31.01,8.21 180 bottom
R2  31.02,10.7 180 bottom
R3  3.34,61.17 0 bottom
R4  13.85,65.48 180 bottom
R5  18.34,52.13 180 top
R6  26.92,60.67 180 top
R7  39.4,10.73 180 bottom
R8  39.4,8.22 180 bottom
R9  28.92,52.3 90 bottom
R10  13.17,50.47 180 top
R13  13.16,46.28 180 top
R14  13.19,48.39 180 top
R15  22.97,37.04 270 bottom
R16  11.43,36.71 270 bottom
R17  13.29,45.44 90 bottom
R18  27.03,36.23 90 bottom
R19  14.55,38.02 0 bottom
R20  13.29,41.23 90 bottom
R21  19.04,39.84 0 bottom
R22  17.06,42 0 bottom
R23  28.4,58.69 270 bottom
R24  30.69,56.39 90 bottom
R25  48.49,58.8 270 top
R26  12.04,56.07 90 bottom
R27  14.18,56.07 270 bottom
R28  16.37,56.09 270 bottom
R29  66.11,46.57 90 top
R30  66.61,43.95 180 top
R31  95.74,68.45 90 top
R32  99.99,63.32 90 top
R33  100.45,60.74 0 top
R34  100.45,58.65 0 top
R35  100.45,56.53 0 top
R36  62.64,49.23 270 bottom
R37  93.2,57.77 270 top
R38  67.27,65.28 180 top
R39  57.89,64.62 325 bottom
R40  100.45,54.43 0 top
R41  99.98,51.85 270 top
R42  95.91,48.41 270 top
R43  65.22,62.48 180 top
R44  55.02,56.67 90 top
R45  57.31,59.58 0 top
R46  58.13,62.24 180 top
R47  66.65,59.63 180 top
R48  64.03,59.39 90 top
R49  79.03,56.12 270 bottom
R50  82.53,59.35 90 bottom
R51  84.79,59.41 270 bottom
R52  3.34,63.34 0 bottom
RCPCKN  81.91,67.63 90 bottom
RDPCKN  59.71,60.72 0 bottom
RLDRM_DET  62.76,62.09 270 bottom
RVC2  58.29,41.51 270 bottom
RVC3  55.83,41.5 270 bottom
RVC4  53.2,41.51 270 bottom
RVC5  50.08,41.53 270 bottom
RVC6  46.93,41.54 270 bottom
RVC7  43.86,41.51 270 bottom
RVC8  41.14,41.52 270 bottom
RVC9  38.67,41.53 270 bottom
SOC_LED1  97.72,63.91 90 top
SOC_LED2  97.71,62.13 90 top
SOC_LED3  97.72,60.34 90 top
SOC_LED4  97.74,58.56 90 top
SOC_LED5  97.73,56.73 90 top
SOC_LED6  97.72,54.94 90 top
SOC_LED7  97.71,53.15 90 top
SOC_LED8  97.72,51.34 90 top
U$1  16.2,18.42 90 bottom
U$2  90.64,50.14 270 top
VIEW_SOC  75.87,52.67 90 top

### Tracks (layer width: path | path; a pad name or v marks a point on that pad's centre or on a via)
DC_IN  (via drill 0.5)
  Top 0.406: R13.2 12.35,48.89 R14.2 12.34,50.98 R10.2 9.76,51 v9.71,51.05
  Top 1.676: DC_IN.2 5.2,55.99 Q3.3
  Bottom 1.016: R3.2 3.25,57.21 DC_IN.2
  Bottom 1.422: R52.2 1.82,61.36 R3.2
  Bottom 1.676: DC_IN.2 9.71,51.98 v9.71,51.05 DC_IN2.3
GND
  Top 0.406: QG1.2 36.07,16.32 38.21,16.32 C1.2
  Bottom 0.406: 5V_FPGA.2 5V_IN.2
  pour Bottom (isolate 0.305): 0,28 0,0 51,0 51,28
  pour Top (isolate 0.406): 0,28 51,28 51,0 0,0
GND4  (via drill 0.5, 1.5)
  Top 0.254: 25.87,40.9 25.23,41.53 CHARGER.17 25.23,45.35 CHARGER.THERMAL
  Top 0.406: R44.2 55,60.07 R46.2 | 25.87,40.9 25.87,39.05 25.84,35.87 Q7.2
  Top 0.813: v20.85,52.37 22.86,54.51 v22.86,55.3 22.89,55.33 C15.1 | v24.94,37.03 20.06,39.95 v15.78,39.99 19.98,39.99 v19.98,42.29
  Top 1.676: v61.11,67.95 61.13,69.09 C23.1 53.41,69.02 C24.1 50.12,69.05 OUT.1 47.69,71 33.03,71 C20.1 C19.1 25.49,71 8,71 7.59,70.59 BAT_TEMP.1 | v52.82,62.38 54.87,62.2 R46.2 | DC_IN2.2 7.31,34.7 25.16,34.65 Q7.2
  Bottom 0.813: C11.2 7.39,66.83 BAT_TEMP.1
  Bottom 1.676: v61.11,67.95 55.56,67.04 v52.82,62.38 | 3.7,43.91 DC_IN2.1 3.71,41.51 DC_IN2.2
  pour Bottom (isolate 0.406): 9.83,33.08 34.05,33.18 33.62,59.55 10.19,59.26 9.81,36.3
  pour Top (isolate 0.406): 0,33 8.5,33 8.5,70 0,70
GND5  (via drill 0.5)
  Top 0.406: 91.28,62.62 91.36,62.36 94.42,62.35 94.43,53.32 90.67,53.32 90.66,50.18 | 90.66,50.18 U$2.2 83.79,50.13 v83.64,50.13 83.21,50.78 v79.48,50.78 | R37.1 93.18,60.16 Q8.2 | v81.96,65.46 86.33,62.35 91.34,62.33 | 90.66,50.18 93.75,50.18 U$2.4 | v67.49,53.2 v64.58,52.94 | v45.03,56.56 v42.25,55.18
  Top 1.676: BAT.1 91.34,62.33 91.28,62.62 Q8.2
  Bottom 0.254: PROTECTION.23 60.88,55.86 60.88,55.37 PROTECTION.24 60.9,55.35 60.9,54.86 | 60.9,54.86 PROTECTION.25 | 64.13,52.82 63.29,52.26 61.55,52.5 61.19,52.86 PROTECTION.29 57.35,52.86 56.59,53.36 55.18,53.36 PROTECTION.11 51.52,53.36 50.06,53.82 | v64.58,52.94 64.57,53.03 | 64.31,54.64 62.52,54.85 60.9,54.86
  Bottom 0.406: C40.1 42.08,52.1 C39.1 42.12,53.93 | v81.96,65.46 81.93,66.06 RCPCKN.1 81.94,65.46 CCCAP.1 78.9,66.04 77.13,67.49 C31.1 C32.1 73.45,67.56 72.36,66.65 GAUGE.14 | C29.1 84.79,56.44 R51.2 84.79,57.89 96.04,57.9 96.95,58.2 96.95,59.67 | C51.2 82.11,50.14 | 82.11,50.14 C50.2 | C33.2 76.84,53.34 75.38,51.34 75.39,48.93 | 75.39,48.93 75.74,48.91 76.54,48.91 77.6,48.91 C30.1 78.9,50.2 v79.48,50.78 | PGM_PWR.1 63.35,40.3 67.65,44.6 67.65,47.97 | 67.65,47.97 67.65,48.45 C34.2 68.08,50.71 C36.2 v67.49,53.2 | IC4.7 94.68,60.58 95.04,60.17 96.51,59.67 96.95,59.67 | 96.95,59.67 96.95,63.94 94.91,65.65 91.19,65.62 BAT.1 | v83.64,50.13 82.17,50.15 82.11,50.14 | 75.39,48.93 73.44,48.92 73.43,48.4 73,47.97 67.65,47.97 | 64.57,53.03 64.31,54.64 CVREG.1 RLDRM_DET.2 | v64.58,52.94 64.13,52.82 | 50.06,53.82 44.37,53.93 42.12,53.93 | CDCAP.1 v45.03,56.56 | v42.25,55.18 42.12,53.93
N$1
  Top 0.305: QG1.3 35.17,21.55 33.98,22.75 27.94,22.75 27.29,23.39 P4.14
N$2  (via drill 0.5)
  Top 0.305: P4.23 15.86,25.98 15.86,22.16 20.91,22.16 21.53,22.17 v21.74,21.92
  Bottom 0.305: v21.74,21.92 20.97,20.7 U$1.P$12
N$3  (via drill 0.5)
  Top 0.305: P4.21 18.4,25.98 23.22,25.98 23.48,25.72 23.48,23.94 23.79,23.53 23.79,18.77 23.79,18.32 v23.53,18.09
  Bottom 0.305: v23.53,18.09 22.5,18.09 U$1.P$16
N$4  (via drill 0.5)
  Top 0.305: P4.15 26.02,25.98 26.02,19.12 22.94,15.98 v22.65,15.67
  Bottom 0.305: U$1.P$18 21.39,16.79 22.32,15.95 22.33,15.93 v22.65,15.67
N$5  (via drill 0.5)
  Top 0.305: P4.22 17.13,22.93 21.57,22.93 22.04,22.93 22.68,22.25 v22.68,20.15
  Bottom 0.305: v22.68,20.15 22.03,19.4 U$1.P$14
N$6  (via drill 0.5)
  Top 0.305: P1.4 5.61,15.8 v9.82,15.81
  Bottom 0.305: v9.82,15.81 10.72,16.8 11.47,16.8 U$1.P$3
N$7  (via drill 0.5)
  Top 0.305: P1.2 4.49,19.62 5.35,20.45 8.79,20.44 v9.32,20.45
  Bottom 0.305: v9.32,20.45 10.52,19.4 11.41,19.4 U$1.P$7
N$8
  Bottom 0.305: P1.1 3.71,22.01 9.08,22.03 10,22.02 11.32,20.7 12.63,20.7 U$1.P$9
N$9  (via drill 0.5)
  Top 0.305: P1.3 3.14,18.34 5.58,18.34 8.17,18.34 v8.81,18.35
  Bottom 0.305: U$1.P$5 12.69,18.1 12.56,18.1 12.55,18.09 9.33,18.11 v8.81,18.35
N$10
  Bottom 0.305: U$1.P$17 20.49,17.43 22.2,17.43 24.99,14.62 25,12.22 25,9.46 26.27,8.2 ENCODER3.3 30.14,8.2 R1.1
N$11
  Bottom 0.305: U$1.P$15 22.67,18.74 23.08,19.16 23.88,19.15 27.29,15.48 ENCODER3.4 30.14,10.73 R2.1
N$13
  Bottom 1.016: R3.1 5.05,60.99 6.59,60.62 C11.1
  Bottom 1.422: R52.1 R3.1
N$14
  Bottom 0.305: U$1.P$13 20.47,20.05 21.4,20.05 22.18,21.05 23.15,21.05 24.32,19.85 30.13,13.99 31.61,14.04 33.38,12.26 33.38,9.46 34.65,8.2 ENCODER4.3 38.52,8.2 R8.1
N$15
  Bottom 0.305: U$1.P$11 20.61,21.35 20.61,22.86 22.54,22.86 22.96,22.46 30.11,15.31 32.62,15.31 35.68,12.25 ENCODER4.4 R7.1
N$16
  Bottom 0.305: U$1.P$8 12.42,20.03 11.07,20.04 9.73,21.39 8.34,21.38 8.24,21.15 6.97,18.53 6.97,9.46 8.75,8.2 ENCODER1.3
N$17
  Bottom 0.305: U$1.P$6 12.43,18.76 10.03,18.76 9.3,19.35 8.34,19.34 7.71,18.37 7.74,12.52 ENCODER1.4
N$18
  Bottom 0.305: U$1.P$4 12.08,17.46 11.62,17.46 10.12,17.43 9.52,17.44 8.76,16.44 8.76,14.26 9.68,13.28 12.05,13.28 15.6,13.28 16.11,12.77 16.11,9.21 17.13,8.2 ENCODER2.3 18.41,8.21
N$19
  Bottom 0.305: U$1.P$2 12.43,16.14 11.2,16.14 10.99,15.52 10.99,14.96 12.14,14.05 13.31,14.04 15.86,14.04 18.4,11.5 ENCODER2.4
N$41  (via drill 0.5)
  Top 0.406: v24.15,57.13 20.31,57.63 Q3.2
  Top 1.676: Q4.2 12.78,61.8 v14.79,61.75 19.59,61.73 Q3.2
  Bottom 0.406: R4.2 14.72,64.1 C12.1 v14.79,61.75 | R9.2 28.89,55.68 24.94,55.68 v24.15,57.13
N$42  (via drill 0.5)
  Top 0.406: v12.81,67.13 12.81,67.96 Q4.1 | v19.42,56.58 19.61,55.75 Q3.1 17.49,53.84 R5.2
  Bottom 0.406: v12.81,67.13 12.84,66.26 R4.1 12.98,64.4 C12.2 12.99,60.16 18.49,59.05 19.41,56.55 v19.42,56.58
N$43
  Top 0.254: CHARGER.3 24.77,50.89 25.03,51.61
  Top 0.406: 25.03,51.61 24.57,52.2 23.76,52.42 23.04,52.12 22.61,51.39 19.57,51.37 R5.1
N$44  (via drill 0.5)
  Top 0.254: CHARGER.7 20.86,47.35 v20.51,48.12
  Bottom 0.406: v20.51,48.12 20.14,48.91 C17.2
N$45  (via drill 0.5)
  Top 0.254: CHARGER.24 28.02,47.35 v28.76,48.68
  Bottom 0.406: v28.76,48.68 v28.75,48.68 C13.2 28.22,50.89 R9.1
N$46  (via drill 0.5)
  Top 0.254: CHARGER.1 25.73,49.67 26.45,50.39
  Top 0.406: R6.1 28.48,60.53 28.4,60.4 C14.2 28.39,52.37 26.45,50.39
  Top 1.676: R6.1 30.31,60.71 30.31,60.83 | 30.31,60.83 v30.3,58.5 30.31,65.48 31.24,65.48 C20.2 | OUT.2 42.05,65.39 32.82,65.39 | Q6.3 37.83,49.03 37.82,51.03 30.31,50.95 30.31,60.83 | 32.82,65.39 C20.2 | C19.2 C20.2 | Q5.2 32.98,65.23 32.82,65.39
  Bottom 0.305: R23.1 28.4,60.27 28.98,60.85 30.34,60.85 v30.3,58.5
  Bottom 0.406: R23.1 C21.1
N$47  (via drill 0.5)
  Top 0.254: CHARGER.12 20.81,44.86 v20.07,44.1
  Bottom 0.406: C18.2 17.97,38.01 17.96,39.17 R21.2 18.03,40.04 R22.1 18.46,42.74 19.05,43.3 19.2,43.44 v20.07,44.1
N$48
  Top 0.254: CHARGER.5 23.72,50.14 23.05,50.55
  Top 0.406: LED1.C 21.69,50.55 23.05,50.55
N$49
  Top 0.254: CHARGER.9 19.57,46.35 18.98,46.94
  Top 0.406: 18.98,46.94 17.22,46.94 LED2.C
N$50
  Top 0.254: CHARGER.8 20.18,46.85 19.53,47.5
  Top 0.406: LED3.C 18.96,47.93 19.53,47.5
N$51
  Top 0.406: R10.1 15.1,50.44 LED1.A
N$52
  Top 0.406: LED2.A 14.11,46.3 R13.1
N$53
  Top 0.406: LED3.A 14.4,48.38 R14.1
N$54
  Bottom 0.406: R28.1 14.26,56.92 R27.1 R26.2 | BAT_TEMP.2 10.12,59.02 10.89,56.91 R26.2 | R26.2
N$55  (via drill 0.5)
  Top 0.254: CHARGER.16 24.73,40.79 v24.76,39.54
  Bottom 0.406: R15.1 22.85,38.43 24.95,38.44 | 24.95,38.44 27.01,38.43 R18.2 | v24.76,39.54 v24.75,39.54 24.75,38.44 24.95,38.44
N$56  (via drill 0.5)
  Top 0.254: CHARGER.15 24.23,40.8 v23.54,39.74
  Bottom 0.406: R16.1 13.54,37.48 | 13.54,37.48 R19.2 | v23.54,39.74 21.39,39.62 21.38,36.54 13.5,36.59 13.54,37.48
N$57  (via drill 0.5)
  Top 0.254: CHARGER.11 19.83,45.35 v18.73,44.5
  Bottom 0.406: R20.2 13.29,43.24 | 13.29,43.24 R17.1 | v18.73,44.5 15.47,44.54 14.31,43.36 13.37,43.32 13.29,43.24
N$58  (via drill 0.5)
  Top 0.406: v60.41,59.26 61.76,57.46 71.15,57.46 71.16,60.26 74.72,60.27 74.72,63.65 77.64,63.65 Q9.3 | 82.31,60.28 82.02,60.89
  Top 1.676: Q8.3 82.02,60.89 Q9.3
  Bottom 0.406: RDPCKN.1 60.49,59.95 v60.41,59.26
N$59  (via drill 0.5)
  Top 0.254: CHARGER.6 23.23,49.74 v22.05,49.51
  Bottom 0.254: PROTECTION.13 51.39,54.36 51.38,54.65 | 51.38,54.65 51.37,54.62 51.41,54.86 PROTECTION.14 | 51.38,54.65 50.16,54.7
  Bottom 0.406: v22.05,49.51 22.06,53.57 22.01,53.55 | 22.01,53.55 16.4,53.57 | 16.4,53.57 R28.2 | 16.4,53.57 16.25,53.34 C28.2 | 50.16,54.7 45.94,54.74 43.22,56.34 43.24,62.81 42.43,63.62 38.69,63.62 37.53,64.78 35.17,64.78 28.35,64.79 23.21,64.26 21.43,62.16 21.43,57.39 21.43,53.56 22.01,53.55
N$60  (via drill 0.5)
  Top 0.406: v35.47,62.98 Q5.1
  Bottom 0.305: v35.47,62.98 24.47,62.98 23.17,61.68 23.17,59.63 24.89,57.91 26.07,57.91 C21.2
  Bottom 0.406: R24.2 R23.2 C21.2
N$61  (via drill 0.5)
  Top 0.406: v68.74,59.62 67.58,59.62 R47.1
  Bottom 0.305: 74.41,64.17 73.85,63.22 GAUGE.13 69.63,63.22 68.7,62.29
  Bottom 0.406: 74.41,64.17 C32.2 | 68.7,62.29 68.7,59.66 v68.74,59.62
N$62  (via drill 0.5)
  Top 0.254: CHARGER.23 28.59,46.85 v29.19,47.46
  Bottom 0.406: v29.19,47.46 30.73,49.89 30.69,54.33 R24.1
N$63
  Top 0.254: CHARGER.21 29.36,45.85 29.63,45.58
  Top 0.406: Q6.1 32.77,47.68 30.17,45.58 29.63,45.58
N$64  (via drill 0.5)
  Top 0.254: CHARGER.20 28.71,45.35 29.75,44.45
  Top 0.406: 29.75,44.45 32.89,41.75 | v32.78,46.3 Q6.2
  Top 1.676: Q7.3 32.88,37.58 32.89,41.75 32.82,42.39 | 32.82,42.39 Q6.2 | L1.P$1 49.63,42.42 32.82,42.39
  Bottom 0.406: C22.1 33.38,45.43 v32.78,46.3
N$65  (via drill 0.5)
  Top 0.254: CHARGER.22 29.27,46.35 v30.22,46.82
  Bottom 0.406: v30.22,46.82 31.62,45.58 D1.3 32.21,43.09 C22.2
N$66
  Bottom 0.254: PROTECTION.31 61.38,51.85 62.55,51.45
  Bottom 0.406: 62.55,51.45 65.23,50.95 65.15,51.03 C36.1 | C36.1 65.24,49.73 C34.1 | C36.1 65.62,51.99 65.56,60.11 D2.C
N$67  (via drill 0.5)
  Top 0.254: CHARGER.14 23.73,41.57 v23.09,40.93
  Top 0.406: v42,58.01 47.03,58.02 R25.2
  Top 1.676: L1.P$2 50.14,56.26 R25.2
  Bottom 0.406: v23.09,40.93 25.84,40.61 29.65,37.89 31.83,37.88 | 31.83,37.88 35.7,37.89 35.73,57.98 35.76,58.01 v42,58.01 | C27.2 31.82,37.68 C26.2 31.8,37.36 31.83,37.88
N$68
  Bottom 0.406: BAT-CELL.8 RVC2.2
N$69  (via drill 0.5)
  Top 0.254: CHARGER.18 25.73,42.55 v27.08,42.55
  Bottom 0.406: D1.1 27.07,42.51 C25.2 27.1,42.63 v27.08,42.55
N$70
  Top 0.254: CHARGER.19 28.04,44.85 28.19,44.77
  Top 0.406: 28.19,44.77 28.19,42.08 Q7.1
N$71
  Bottom 0.254: PROTECTION.8 49.98,51.87 48.67,51.21
  Bottom 0.406: RVC9.1 38.3,43.05 CVC8.2 38.32,43.76 38.32,46.03 47.48,50.59 48.67,51.21
N$72
  Bottom 0.254: PROTECTION.36 61.65,49.36 62.16,48.27
  Bottom 0.406: RVC2.1 58.61,42.38 CVC2.1 58.68,45.14 62.16,48.27 62.15,48.29 62.86,48.24 R36.2
N$73
  Bottom 0.254: PROTECTION.3 51.56,49.37 51.04,48.27
  Bottom 0.406: CVC4.2 50.07,45.09 49.95,45.13 | 49.95,45.13 CVC5.1 | RVC5.1 50,45.18 | 51.04,48.27 49.95,46.75 49.94,46.44 49.99,45.55 50,45.18 | 50,45.18 49.95,45.13
N$74
  Bottom 0.254: PROTECTION.38 58.53,48.37 57.96,47.86
  Bottom 0.406: CVC2.2 56.25,45.1 56.2,45.5 | 56.2,45.5 CVC3.1 | RVC3.1 56.22,42.49 56.2,45.5 | 57.96,47.86 56.2,45.5
N$75
  Bottom 0.254: PROTECTION.34 62.69,50.36 62.68,50.34
  Bottom 0.406: 62.68,50.34 62.85,50.32 R36.1
N$76
  Bottom 0.254: PROTECTION.6 51.29,50.86 49.92,49.98
  Bottom 0.406: CVC6.2 43.85,45.14 43.82,45.12 | 43.82,45.12 CVC7.1 | RVC7.1 43.86,45.07 43.82,45.12 | 49.92,49.98 43.85,46.05 43.82,45.12
N$77
  Bottom 0.254: PROTECTION.5 51.71,50.36 50.15,48.78
  Bottom 0.406: CVC5.2 46.85,45.19 46.87,45.24 | 46.87,45.24 46.9,45.08 | 46.9,45.08 CVC6.1 | RVC6.1 46.94,43.3 46.9,45.08 | 50.15,48.78 47.05,46.64 46.85,46.25 46.87,45.24
N$78
  Bottom 0.254: PROTECTION.1 53.18,47.6
  Bottom 0.406: CVC3.2 53.14,45.18 53.28,45.21 | 53.28,45.21 CVC4.1 | RVC4.1 53.16,45.21 53.28,45.21 | 53.18,47.6 53.1,46.03 53.1,43.78 53.28,45.21
N$79
  Bottom 0.406: RVC3.2 BAT-CELL.7
N$80
  Bottom 0.406: BAT-CELL.6 RVC4.2
N$81
  Bottom 0.406: BAT-CELL.5 RVC5.2
N$82
  Bottom 0.406: RVC6.2 BAT-CELL.4
N$83
  Bottom 0.406: RVC7.2 BAT-CELL.3
N$84
  Bottom 0.406: RVC8.2 BAT-CELL.2
N$85
  Bottom 0.406: BAT-CELL.1 RVC9.2
N$86
  Bottom 0.305: GAUGE.7 79.04,59.79
  Bottom 0.406: R49.1 79.04,59.79 76.84,57.49 C33.1
N$87  (via drill 0.5)
  Top 0.406: Q9.1 68.23,66.96 v65.65,66.97 66.42,66.96 R38.2
  Bottom 0.406: v65.65,66.97 64.02,66.98 R39.1
N$88  (via drill 0.5)
  Top 0.406: R37.2 93.16,55.6 Q8.1 90.34,54.21 80.62,54.2 80.61,58.87 72.06,58.88 72.06,56.67 62.6,56.67 62.12,56.45 v61.9,56.34
  Bottom 0.254: PROTECTION.21 61.3,56.85 v61.9,56.34
N$89
  Bottom 0.254: PROTECTION.17 51.22,56.36 50.12,57.94
  Bottom 0.406: 50.12,57.94 50.45,59.2 51.59,59.78 52.91,60.17 54.76,61.15 55.58,62.89 R39.2
N$90
  Bottom 0.254: PROTECTION.16 51.81,55.86 51.8,55.87 49.58,55.9
  Bottom 0.406: 49.58,55.9 CDCAP.2
N$91
  Bottom 0.254: PROTECTION.7 50.95,51.36 49.12,50.42
  Bottom 0.406: CVC7.2 40.93,45.13 40.78,45.09 | 40.78,45.09 CVC8.1 | RVC8.1 40.76,43.3 40.78,45.09 | 49.12,50.42 40.8,46 40.78,45.09
N$92
  Bottom 0.254: 51.14,58.32 51.09,57.67 51.75,56.86 PROTECTION.18 55.79,56.86 56.78,57.86
  Bottom 0.406: 51.14,58.32 51.33,58.68 52.87,59.1 55.65,60.33 57.82,62.41 62.19,63.23 RLDRM_DET.1 | RDPCKN.2 57.45,58.56 56.78,57.86
N$93
  Top 0.406: SOC_LED1.A 98.24,64.47 96.64,65.98 R31.1
N$94  (via drill 0.5)
  Top 0.406: v53.23,58.2 51.56,58.12 v50.54,60.47
  Bottom 0.254: PROTECTION.19 53.23,58.18
  Bottom 0.406: 53.23,58.18 v53.23,58.2 | v50.54,60.47 50.54,65.64 54.79,69.89 81.92,69.89 RCPCKN.2
N$95  (via drill 0.5)
  Top 0.406: v63.05,55.67 66.33,55.67 v66.64,55.67
  Bottom 0.254: PROTECTION.20 62.73,57.36 v63.05,55.67
  Bottom 0.406: v66.64,55.67 67.52,65.39 71.54,68.91 79.76,68.88 CCCAP.2
N$96
  Top 0.406: SOC_LED2.A R32.1
N$97  (via drill 0.5)
  Top 0.406: v56.26,51.24 56.26,59.37 R45.1
  Bottom 0.254: 55.79,52.76 55.8,52.86 PROTECTION.10 51.26,52.85 48.81,53.1
  Bottom 0.406: 55.79,52.76 v56.26,51.24 | 48.81,53.1 47.88,53.02 C39.2
N$99  (via drill 0.5)
  Top 0.406: v55.42,50.06 55.03,50.56 R44.1
  Bottom 0.254: v55.42,50.06 54.98,52.37 PROTECTION.9 48.84,52.36 47.88,51.97
  Bottom 0.406: C40.2 46.83,51.62 47.88,51.97
N$100  (via drill 0.5)
  Top 0.406: v62.12,53.35 62.22,52.1 | 62.22,52.1 62.38,48.18 62.39,46.52 60.87,45.26 I2C_PGM.1 60.84,43.25 62.37,41.72 64.31,41.72 65.76,43.17 R30.2 | v68.67,54.4 68.66,50.87 62.26,50.91 62.22,52.1
  Bottom 0.254: PROTECTION.27 61.52,53.88 v62.12,53.35
  Bottom 0.305: GAUGE.9 70.51,60.63 70.52,59.06
  Bottom 0.406: 70.52,59.06 70.86,58.07 70.09,57.08 68.73,57.09 v68.67,54.4
N$101
  Top 0.406: I2C_PGM.2 64.24,47.71 66.11,47.71 | 66.11,47.71 66.1,49.97 I2C_SELECT.1 | R29.2 66.11,47.46 66.11,47.71
N$102
  Top 0.406: SOC_LED3.A R33.1
N$103  (via drill 0.5)
  Top 0.406: PGM_ENABLE.2 63.19,39.76 59.89,39.77 58.53,41.31 58.55,46.47 58.56,55.73 v57.53,56.38
  Bottom 0.254: v57.53,56.38 58.35,56.36 PROTECTION.22
N$104  (via drill 0.5)
  Top 0.406: v57.38,55.01 57.62,54.53 57.59,40.82 PGM_PWR.2
  Bottom 0.254: PROTECTION.28 58.14,53.37 v57.38,55.01
N$105  (via drill 0.5)
  Top 0.406: R31.2 96.54,68.88 97.44,66.58 R32.2 101.3,63.48 R33.2 R34.2 R35.2 R40.2 101.3,51.66 R41.2 99.76,50.55 97.91,49.63 96.31,47.38 R42.2 95.89,47.71 95.9,47.28 94.58,47.25 88.37,47.26 U$2.3 85.36,47.86 v83.76,47.82
  Bottom 0.305: GAUGE.6 79.94,60.62 79.94,61.27 GAUGE.5 | GAUGE.5
  Bottom 0.406: IC4.14 C29.2 | 79.94,60.62 80.88,60.6 80.88,49.77 | 80.88,49.77 80.89,47.8 C51.1 83.36,47.8 v83.76,47.82 84.69,48.88 84.72,54.42 IC4.14 | C30.2 80.89,48.84 80.88,49.77 | IC4.14 86.36,52.48 88.79,48.99 96.16,48.99 97.67,50.74 97.67,53.96 97.67,54.22 94.85,54.23 94.84,53.22 94.48,52.9 93.15,52.9 92.72,53.2 IC4.9
N$106
  Top 0.406: SOC_LED4.A R34.1
N$107
  Top 0.406: SOC_LED5.A R35.1
N$108
  Top 0.406: R40.1 SOC_LED6.A
N$109
  Top 0.406: R41.1 SOC_LED7.A
N$110
  Top 0.406: R42.1 98.24,50.77 SOC_LED8.A
N$111  (via drill 0.5)
  Top 0.406: v95.89,50.44 95.89,50.45 SOC_LED8.C
  Bottom 0.406: IC4.13 87.65,52.65 89.33,50.01 95.16,49.99 v95.89,50.44
N$112  (via drill 0.5)
  Top 0.406: SOC_LED1.C v94.86,64.22 v94.86,64.23
  Bottom 0.406: v94.86,64.23 94.23,63.86 90.19,63.89 88.92,62.55 IC4.3
N$113  (via drill 0.5)
  Top 0.406: v95.6,63.01 95.76,62.99 SOC_LED2.C
  Bottom 0.406: IC4.4 90.22,62.33 90.95,63.06 95.01,63.06 95.41,63.08 v95.6,63.01
N$114  (via drill 0.5)
  Top 0.406: v95.71,61.25 SOC_LED3.C
  Bottom 0.406: IC4.5 91.47,61.88 91.74,62.16 95.21,62.17 95.71,61.67 v95.71,61.25
N$115  (via drill 0.5)
  Top 0.406: v95.67,58.86 SOC_LED4.C
  Bottom 0.406: IC4.6 92.69,58.72 95.19,58.69 v95.67,58.86
N$116  (via drill 0.5)
  Top 0.406: SOC_LED5.C v95.77,56.78
  Bottom 0.406: v95.77,56.78 91.47,56.78 IC4.10
N$118  (via drill 0.5)
  Top 0.406: SOC_LED7.C 96.64,52.4 96.08,52.17 95.8,51.57 v95.77,51.56
  Bottom 0.406: v95.77,51.56 94.91,51.09 89.88,51.07 88.92,52.72 IC4.12
N$120  (via drill 0.5)
  Top 0.406: v63.4,53.75 67.17,54.51 68.06,55.56 70.63,55.56 I2C_SELECT.3
  Bottom 0.254: PROTECTION.26 62.04,54.36 62.61,54.12 v63.4,53.75
N$121
  Bottom 0.305: GAUGE.8 73.26,59.96 73.26,59.1
  Bottom 0.406: 73.26,59.1 73.23,52.5 I2C_SELECT.2
N$122  (via drill 0.5)
  Top 0.406: R48.1 63.99,58.24 69.54,58.24 v69.65,58.45
  Bottom 0.305: 70.53,62.57 GAUGE.12 74.68,62.57 74.75,62.64
  Bottom 0.406: 70.53,62.57 70.03,62.57 69.64,62.18 v69.65,58.45 | C31.2 76.64,64.52 74.75,62.64
N$123
  Bottom 0.305: GAUGE.3 81.36,62.57 81.96,61.97
  Bottom 0.406: IC4.2 87.64,61.96 86.36,61.96 | 86.36,61.96 IC4.1 | 81.96,61.97 86.35,61.97 86.36,61.96
N$124
  Bottom 0.305: GAUGE.1 82.22,63.87 82.23,63.88
  Bottom 0.406: 82.23,63.88 83.11,65.1 83.12,69.88 91.21,69.83 92.61,68.34 95.89,66.6 97.95,64.39 97.94,55.65 94.03,55.63 94.03,54.43 IC4.8
N$126  (via drill 0.5)
  Top 0.406: 73.64,51.32 VIEW_SOC.P$1 | v77.03,51.31 73.64,51.32 | 73.64,51.32 VIEW_SOC.P$2
  Bottom 0.406: R49.2 78.23,53.02 v77.03,51.31
N$127  (via drill 0.5)
  Top 0.406: v75.25,53.3 77.91,53.33 78.04,53.32 78.12,53.48 | VIEW_SOC.P$4 78.12,55.37 78.12,53.48 | 78.12,53.48 78.14,49.85 VIEW_SOC.P$3
  Bottom 0.305: GAUGE.2 76.69,63.22 75.27,61.55
  Bottom 0.406: 76.64,63.08 75.27,61.55 v75.25,53.3
N$128
  Bottom 0.305: GAUGE.4 80.91,61.92 R50.2
  Bottom 0.406: R50.2 84.75,60.3 R51.1
N$129  (via drill 0.5)
  Top 0.254: CHARGER.13 23.23,42.55 v21.94,41.87
  Top 0.406: v41.97,59.71 47.17,59.72 R25.1 | v63.38,65.33 63.4,65.23 63.49,65.93 | v83.63,52.47 v85.81,51.47 U$2.1 | BAT.2 86.09,66.62 89.24,69.78 92.69,69.76 v93.29,69.65
  Top 1.676: BAT.2 83.96,68.76 83.78,68.77 83.86,68.76 83.56,68.77 80.44,68.8 78.02,68.79 64.05,68.82 63.49,65.93 v63.38,65.33 C23.2 C24.2 51.16,65.17 49.73,62.54 48.48,62.56 | 48.48,62.56 R25.1 | Q5.3 37.32,57.88 39.86,57.91 39.87,62.58 48.48,62.56
  Bottom 0.406: C18.1 20,38.24 R21.1 20.57,40.91 v21.94,41.87 23.43,42.13 26.24,41.46 28.4,40.48 31.72,40.48 | 31.72,40.48 34.65,40.5 34.68,59.71 v41.97,59.71 | D2.A 65.01,64.76 v63.38,65.33 | R50.1 82.41,53.13 C50.1 83.6,52.46 v83.63,52.47 | v93.29,69.65 96.33,67.45 98.89,64.84 98.82,51 96.87,48.11 88.02,48.1 85.85,51.4 v85.81,51.47 | C26.1 31.8,40.11 31.72,40.48
N$130  (via drill 0.5)
  Top 0.406: v59.43,58.25 59.44,55.17 59.37,53.56 59.42,42.25 60.88,40.76 65.18,40.76 PGM_ENABLE.1 67.46,40.7 R30.1 67.46,45.69 R29.1
  Bottom 0.254: PROTECTION.12 54.77,53.87 55.99,56.12 57.01,56.96 58.42,58.25
  Bottom 0.406: 58.42,58.25 v59.43,58.25 61.54,58.25 CVREG.2
N$131
  Top 0.406: R45.2 60.31,60.48 R46.1 | R43.2 64,60.89 R48.2
  Top 1.676: R43.2 61.91,62.51 R46.1
N$132
  Top 0.406: R38.1 68.13,63.35 | 68.13,63.35 R43.1 | 68.13,63.35 65.83,59.99 R47.2
  Top 1.676: Q9.2 69.39,62.22 R43.1
SI7617DN
  Top 0.254: CHARGER.2 25.23,50.3 25.77,50.95
  Top 0.406: 25.77,50.95 26.68,52 26.7,55.78 | 26.7,55.78 C14.1 26.57,58.11 R6.2 | C15.2 26.7,55.33 26.7,55.78
  Top 1.676: Q4.3 20.14,65.94 22.37,65.95 R6.2
SOC_LED6  (via drill 0.5)
  Top 0.406: SOC_LED6.C 95.81,54.96 v95.8,53.09
  Bottom 0.406: v95.8,53.09 95.36,52.38 94.49,51.9 90.59,51.88 90.17,53.2 IC4.11
VCC3.3  (via drill 0.5)
  Top 0.305: QG1.4 28.96,20.25 22.45,13.74 21.4,13.74 v21.21,13.76
  Top 0.406: QG1.4 32.23,18.86 38.21,18.86 C1.1
  Bottom 0.305: P4.28 11.79,22.67 15.1,22.67 | 15.1,22.67 15.1,21.15 16.37,19.88 16.37,17.34 18.2,15.5 U$1.P$20 20.14,15.5 20.65,15.52 21.2,13.91 v21.21,13.76 | C4.2 15.1,22.67
VCC5V
  Bottom 0.305: 41.96,10.74 41.95,10.73 R7.2 | R8.2 41.96,8.22 | R2.2 32.37,10.69 32.37,8.2 | 32.37,8.2 32.37,8.21 R1.2 32.37,8.2 | 32.37,8.2 32.37,3.12 | ENCODER1.1 ENCODER2.1 ENCODER3.1 32.37,3.12 | 41.96,3.12 ENCODER4.1 32.37,3.12
  Bottom 0.406: 5V_FPGA.1 5V_IN.1 41.96,10.74 41.96,8.22 41.96,3.12
VREF  (via drill 0.5)
  Top 0.254: CHARGER.10 19.1,45.85 v18.64,45.86 | CHARGER.4 24.23,51.07 v23.9,51.26
  Bottom 0.406: 16.57,46.4 18.09,46.41 v18.64,45.86 v18.65,45.85 20.48,45.85 23.89,49.32 v23.9,51.26 | 16.57,46.4 14.82,46.4 | 14.82,46.4 R17.2 | R17.2 | 16.57,46.4 C16.2 | R15.2 23.36,35.79 R16.2 10.1,35.76 10.08,39.78 11.71,40.45 11.69,46.42 13.27,46.42 R17.2 | R26.1 12.04,50.51 14.79,47.77 14.79,46.43 14.82,46.4